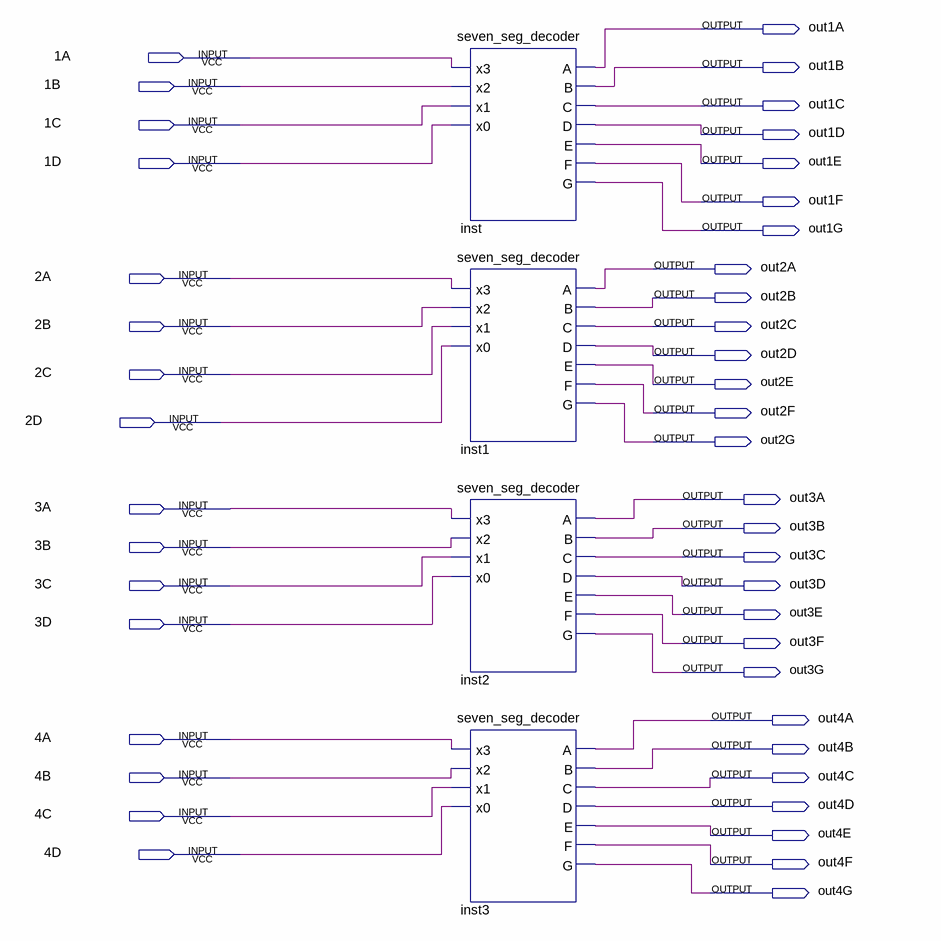
[diagram p0: schematic sheet]
// Quartus schematic lab5step1.bdf as structural Verilog: 4 symbols, 44 pins
module lab5step1 (
  input  \1A ,
  input  \1B ,
  input  \1C ,
  input  \1D ,
  input  \2A ,
  input  \2B ,
  input  \2C ,
  input  \2D ,
  input  \3A ,
  input  \3B ,
  input  \3C ,
  input  \3D ,
  input  \4A ,
  input  \4B ,
  input  \4C ,
  input  \4D ,
  output out1A,
  output out1B,
  output out1C,
  output out1D,
  output out1E,
  output out1F,
  output out1G,
  output out2A,
  output out2B,
  output out2C,
  output out2D,
  output out2E,
  output out2F,
  output out2G,
  output out3A,
  output out3B,
  output out3C,
  output out3D,
  output out3E,
  output out3F,
  output out3G,
  output out4A,
  output out4B,
  output out4C,
  output out4D,
  output out4E,
  output out4F,
  output out4G
);

  seven_seg_decoder inst (
    .x3(\1A ), .x2(\1B ), .x1(\1C ), .x0(\1D ), .A(out1A), .B(out1B), .C(out1C), .D(out1D), .E(out1E),
    .F(out1F), .G(out1G));
  seven_seg_decoder inst1 (
    .x3(\2A ), .x2(\2B ), .x1(\2C ), .x0(\2D ), .A(out2A), .B(out2B), .C(out2C), .D(out2D), .E(out2E),
    .F(out2F), .G(out2G));
  seven_seg_decoder inst2 (
    .x3(\3A ), .x2(\3B ), .x1(\3C ), .x0(\3D ), .A(out3A), .B(out3B), .C(out3C), .D(out3D), .E(out3E),
    .F(out3F), .G(out3G));
  seven_seg_decoder inst3 (
    .x3(\4A ), .x2(\4B ), .x1(\4C ), .x0(\4D ), .A(out4A), .B(out4B), .C(out4C), .D(out4D), .E(out4E),
    .F(out4F), .G(out4G));
endmodule
